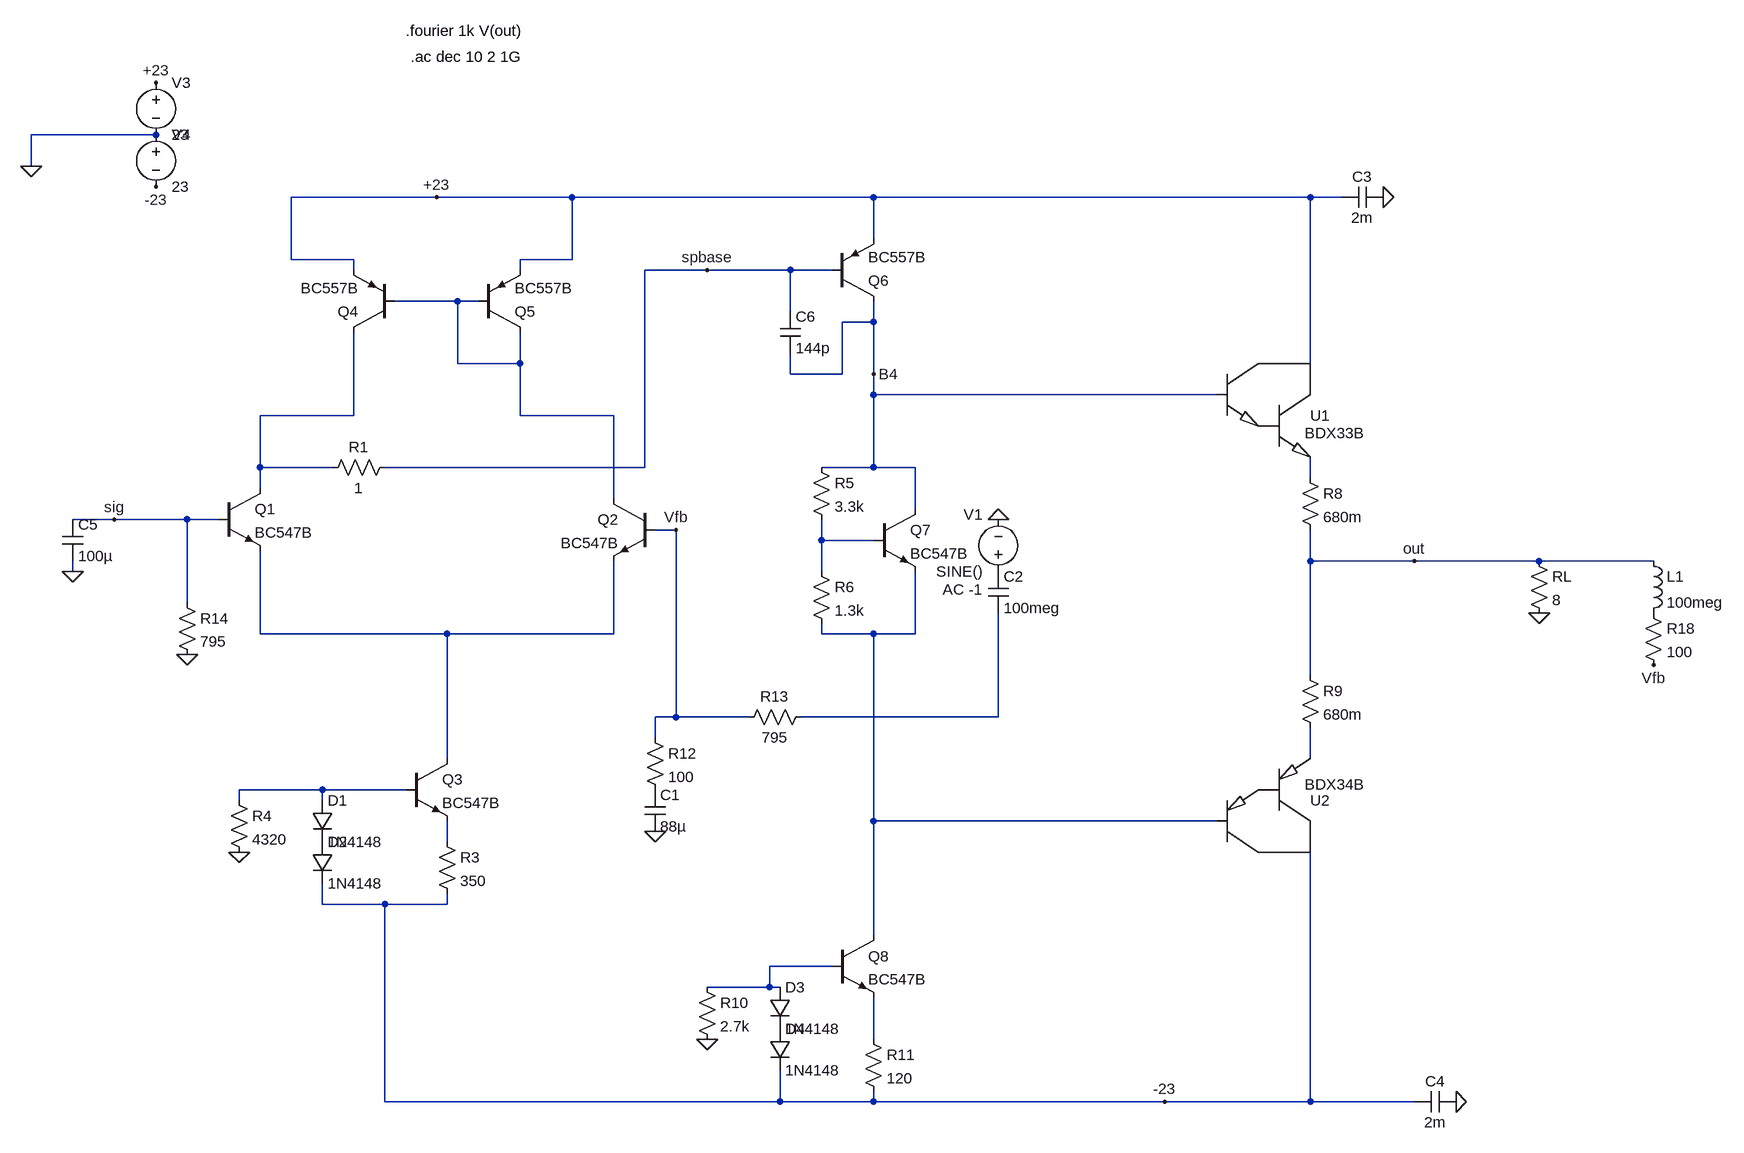
[diagram p0: schematic effektforstaerker-openloop.asc]
effektforstaerker-openloop.asc, the LTspice schematic file:
Version 4
SHEET 1 2440 1380
WIRE -96 -192 -288 -192
WIRE -288 -144 -288 -192
WIRE 336 -96 112 -96
WIRE 544 -96 336 -96
WIRE 1008 -96 544 -96
WIRE 1680 -96 1008 -96
WIRE 1728 -96 1680 -96
WIRE 1008 -32 1008 -96
WIRE 112 0 112 -96
WIRE 208 0 112 0
WIRE 544 0 544 -96
WIRE 544 0 464 0
WIRE 208 16 208 0
WIRE 464 16 464 0
WIRE 752 16 656 16
WIRE 880 16 752 16
WIRE 944 16 880 16
WIRE 368 64 272 64
WIRE 400 64 368 64
WIRE 880 80 880 16
WIRE 1008 96 1008 64
WIRE 1008 96 960 96
WIRE 368 160 368 64
WIRE 464 160 464 112
WIRE 464 160 368 160
WIRE 1680 160 1680 -96
WIRE 880 176 880 144
WIRE 960 176 960 96
WIRE 960 176 880 176
WIRE 1008 176 1008 96
WIRE 1008 208 1008 176
WIRE 1536 208 1008 208
WIRE 208 240 208 112
WIRE 208 240 64 240
WIRE 464 240 464 160
WIRE 608 240 464 240
WIRE 64 320 64 240
WIRE 176 320 64 320
WIRE 656 320 656 16
WIRE 656 320 256 320
WIRE 1008 320 1008 208
WIRE 1008 320 928 320
WIRE 1072 320 1008 320
WIRE 1680 336 1680 304
WIRE 64 352 64 320
WIRE 608 368 608 240
WIRE 1072 384 1072 320
WIRE -160 400 -224 400
WIRE -48 400 -160 400
WIRE 0 400 -48 400
WIRE 704 416 672 416
WIRE 928 432 928 400
WIRE 1008 432 928 432
WIRE 1680 464 1680 416
WIRE 1840 464 1680 464
WIRE 2032 464 1840 464
WIRE 2208 464 2032 464
WIRE -224 480 -224 464
WIRE 928 480 928 432
WIRE -48 528 -48 400
WIRE 64 576 64 448
WIRE 352 576 64 576
WIRE 608 576 608 464
WIRE 608 576 352 576
WIRE 928 576 928 560
WIRE 1008 576 928 576
WIRE 1072 576 1072 480
WIRE 1072 576 1008 576
WIRE 1680 640 1680 464
WIRE 704 704 704 416
WIRE 704 704 672 704
WIRE 816 704 704 704
WIRE 1200 704 1200 544
WIRE 1200 704 896 704
WIRE 672 736 672 704
WIRE 352 768 352 576
WIRE 1680 768 1680 720
WIRE 160 816 32 816
WIRE 288 816 160 816
WIRE 32 832 32 816
WIRE 160 832 160 816
WIRE 1008 864 1008 576
WIRE 1536 864 1008 864
WIRE 352 896 352 864
WIRE 160 992 160 960
WIRE 256 992 160 992
WIRE 352 992 352 976
WIRE 352 992 256 992
WIRE 1008 1040 1008 864
WIRE 944 1088 848 1088
WIRE 848 1120 848 1088
WIRE 848 1120 752 1120
WIRE 864 1120 848 1120
WIRE 1008 1200 1008 1136
WIRE 256 1296 256 992
WIRE 864 1296 864 1248
WIRE 864 1296 256 1296
WIRE 1008 1296 1008 1280
WIRE 1008 1296 864 1296
WIRE 1456 1296 1008 1296
WIRE 1680 1296 1680 912
WIRE 1680 1296 1456 1296
WIRE 1840 1296 1680 1296
FLAG 32 912 0
FLAG -224 480 0
FLAG -288 -144 0
FLAG 336 -96 +23
FLAG -96 -272 +23
FLAG -96 -112 -23
FLAG 2032 544 0
FLAG 1456 1296 -23
FLAG 752 1200 0
FLAG 672 880 0
FLAG -48 608 0
FLAG 1792 -96 0
FLAG 1904 1296 0
FLAG 1840 464 out
FLAG -160 400 sig
FLAG 2208 624 Vfb
FLAG 704 416 Vfb
FLAG 1200 400 0
FLAG 1008 176 B4
FLAG 752 16 spbase
SYMBOL res 336 880 R0
SYMATTR InstName R3
SYMATTR Value 350
SYMBOL npn 0 352 R0
SYMATTR InstName Q1
SYMATTR Value BC547B
SYMBOL npn 672 368 M0
SYMATTR InstName Q2
SYMATTR Value BC547B
SYMBOL npn 288 768 R0
SYMATTR InstName Q3
SYMATTR Value BC547B
SYMBOL pnp 272 112 R180
SYMATTR InstName Q4
SYMATTR Value BC557B
SYMBOL pnp 400 112 M180
SYMATTR InstName Q5
SYMATTR Value BC557B
SYMBOL diode 144 832 R0
SYMATTR InstName D1
SYMATTR Value 1N4148
SYMBOL diode 144 896 R0
SYMATTR InstName D2
SYMATTR Value 1N4148
SYMBOL res 16 816 R0
SYMATTR InstName R4
SYMATTR Value 4320
SYMBOL voltage -96 -288 R0
WINDOW 123 0 0 Left 0
WINDOW 39 0 0 Left 0
SYMATTR InstName V3
SYMATTR Value 23
SYMBOL voltage -96 -208 R0
WINDOW 123 0 0 Left 0
WINDOW 39 0 0 Left 0
SYMATTR InstName V4
SYMATTR Value 23
SYMBOL pnp 944 64 M180
SYMATTR InstName Q6
SYMATTR Value BC557B
SYMBOL npn 1008 384 R0
SYMATTR InstName Q7
SYMATTR Value BC547B
SYMBOL res 912 304 R0
SYMATTR InstName R5
SYMATTR Value 3.3k
SYMBOL res 912 464 R0
SYMATTR InstName R6
SYMATTR Value 1.3k
SYMBOL myLib\\BDX33B 1552 160 R0
SYMATTR InstName U1
SYMBOL myLib\\BDX34B 1536 912 M180
SYMATTR InstName U2
SYMBOL res 2016 448 R0
SYMATTR InstName RL
SYMATTR Value 8
SYMBOL res 1664 320 R0
SYMATTR InstName R8
SYMATTR Value 680m
SYMBOL res 1664 624 R0
SYMATTR InstName R9
SYMATTR Value 680m
SYMBOL res 736 1104 R0
SYMATTR InstName R10
SYMATTR Value 2.7k
SYMBOL res 992 1184 R0
SYMATTR InstName R11
SYMATTR Value 120
SYMBOL npn 944 1040 R0
SYMATTR InstName Q8
SYMATTR Value BC547B
SYMBOL diode 848 1120 R0
SYMATTR InstName D3
SYMATTR Value 1N4148
SYMBOL diode 848 1184 R0
SYMATTR InstName D4
SYMATTR Value 1N4148
SYMBOL res 656 720 R0
SYMATTR InstName R12
SYMATTR Value 100
SYMBOL res 912 688 R90
WINDOW 0 0 56 VBottom 0
WINDOW 3 32 56 VTop 0
SYMATTR InstName R13
SYMATTR Value 795
SYMBOL cap 656 816 R0
SYMATTR InstName C1
SYMATTR Value 88µ
SYMBOL res -64 512 R0
SYMATTR InstName R14
SYMATTR Value 795
SYMBOL cap 1728 -80 R270
WINDOW 0 32 32 VTop 0
WINDOW 3 0 32 VBottom 0
SYMATTR InstName C3
SYMATTR Value 2m
SYMBOL cap 1904 1280 R90
WINDOW 0 0 32 VBottom 0
WINDOW 3 32 32 VTop 0
SYMATTR InstName C4
SYMATTR Value 2m
SYMBOL res 2192 528 R0
SYMATTR InstName R18
SYMATTR Value 100
SYMBOL ind 2192 448 R0
SYMATTR InstName L1
SYMATTR Value 100meg
SYMBOL cap 1184 480 R0
SYMATTR InstName C2
SYMATTR Value 100meg
SYMBOL voltage 1200 496 R180
WINDOW 0 24 104 Left 0
WINDOW 3 24 16 Left 0
WINDOW 123 24 -12 Left 0
WINDOW 39 0 0 Left 0
SYMATTR InstName V1
SYMATTR Value SINE()
SYMATTR Value2 AC -1
SYMBOL cap -240 400 R0
SYMATTR InstName C5
SYMATTR Value 100µ
SYMBOL res 160 336 R270
WINDOW 0 32 56 VTop 0
WINDOW 3 0 56 VBottom 0
SYMATTR InstName R1
SYMATTR Value 1
SYMBOL cap 864 80 R0
SYMATTR InstName C6
SYMATTR Value 144p
TEXT 296 -312 Left 0 !.ac dec 10 2 1G
TEXT 288 -352 Left 0 !.fourier 1k V(out)

The netlist it stands for:
* effektforstaerker-openloop.asc
R3 N010 -23 350
Q1 N002 sig N005 0 BC547B
Q2 N001 Vfb N005 0 BC547B
Q3 N005 N009 N010 0 BC547B
Q4 N002 N001 +23 0 BC557B
Q5 N001 N001 +23 0 BC557B
D1 N009 P001 1N4148
D2 P001 -23 1N4148
R4 N009 0 4320
V3 +23 0 23
V4 0 -23 23
Q6 B4 spbase +23 0 BC557B
Q7 B4 N004 N006 0 BC547B
R5 B4 N004 3.3k
R6 N004 N006 1.3k
XU1 +23 B4 N003 BDX33B  ; pins C B E
XU2 -23 N006 N008 BDX34B  ; pins C B E
RL out 0 8
R8 N003 out 680m
R9 out N008 680m
R10 N011 0 2.7k
R11 N012 -23 120
Q8 N006 N011 N012 0 BC547B
D3 N011 P002 1N4148
D4 P002 -23 1N4148
R12 Vfb P003 100
R13 N007 Vfb 795
C1 P003 0 88µ
R14 sig 0 795
C3 +23 0 2m
C4 0 -23 2m
R18 P004 Vfb 100
L1 out P004 100meg
C2 P005 N007 100meg
V1 P005 0 SINE() AC -1
C5 sig 0 100µ
R1 N002 spbase 1
C6 spbase B4 144p
.model D D
.lib standard.dio
.model NPN NPN
.model PNP PNP
.lib standard.bjt
.ac dec 10 2 1G
.fourier 1k V(out)
.lib myLib\BDX33B.lib
.lib myLib\BDX34B.lib
.backanno
.end